# Altium schematic sheet SupplyAnalog.SchDoc
size A3; SheetNumber: 4; SheetTotal: 4
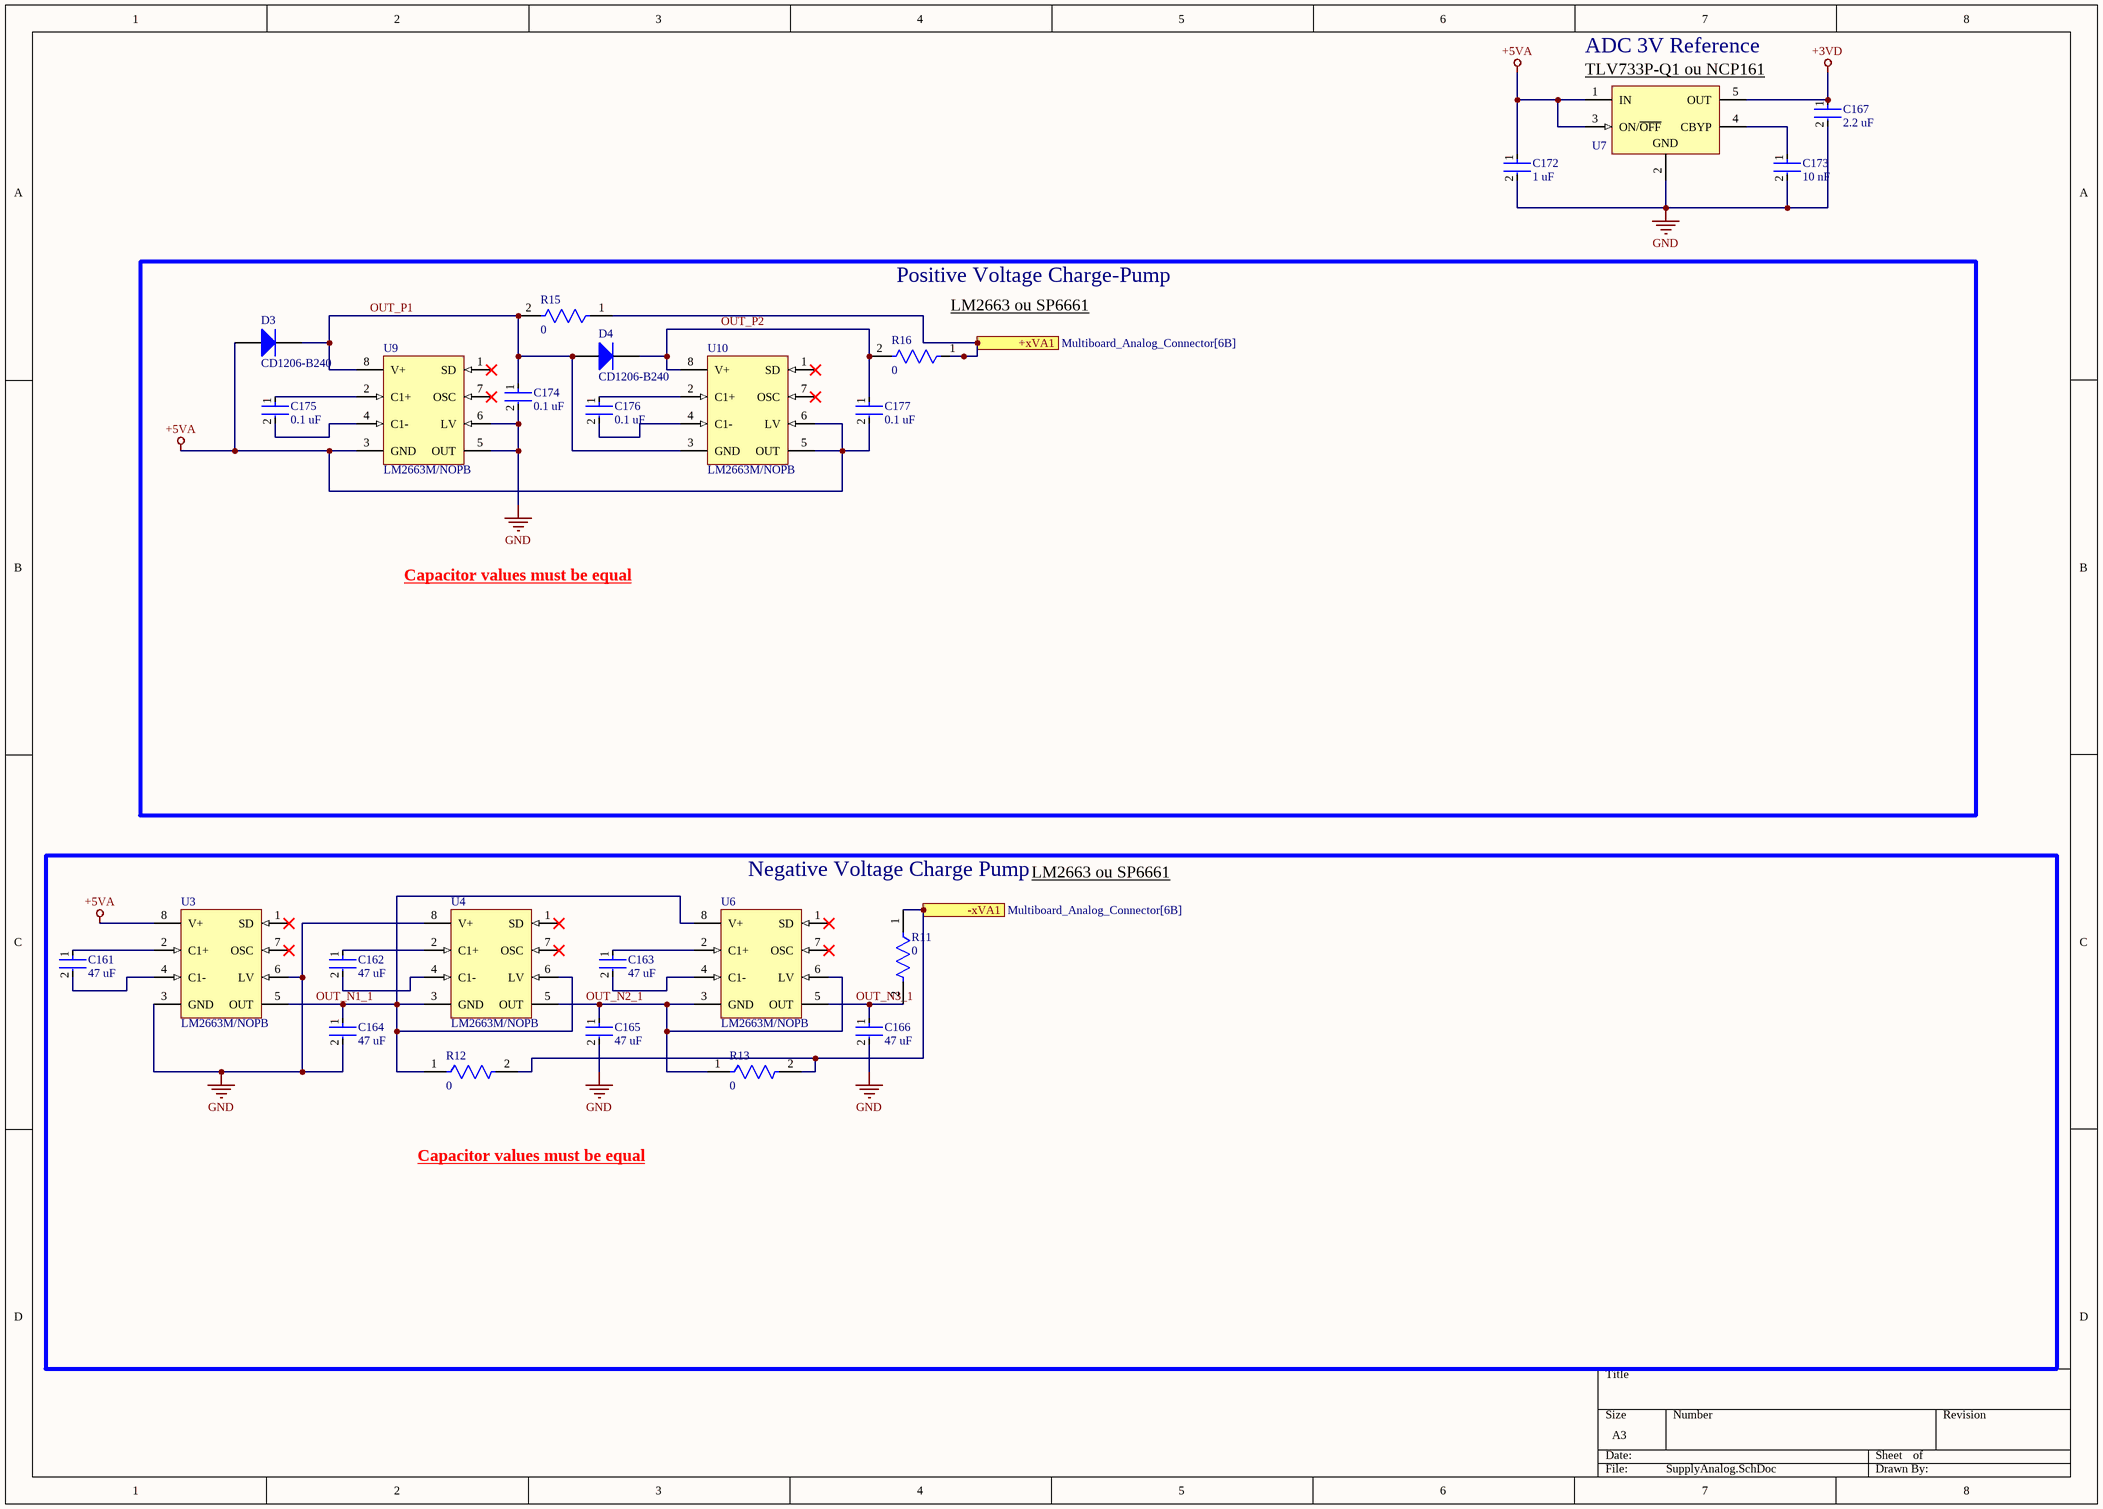
[diagram p0: SupplyAnalog.SchDoc]

## Parts
C161  47 uF  [FP-CC0805-0_85-MFG]
C162  47 uF  [FP-CC0805-0_85-MFG]
C163  47 uF  [FP-CC0805-0_85-MFG]
C164  47 uF  [FP-CC0805-0_85-MFG]
C165  47 uF  [FP-CC0805-0_85-MFG]
C166  47 uF  [FP-CC0805-0_85-MFG]
C167  2.2 uF  [FP-CC0805-0_85-MFG]
C172  1 uF  [FP-CC0805-0_85-MFG]
C173  10 nF  [FP-CC0805-0_85-MFG]
C174  0.1 uF  [FP-CC0805-0_85-MFG]
C175  0.1 uF  [FP-CC0805-0_85-MFG]
C176  0.1 uF  [FP-CC0805-0_85-MFG]
C177  0.1 uF  [FP-CC0805-0_85-MFG]
D3  CD1206-B240  [BOUR-CD1206-S01575-2_L]
D4  CD1206-B240  [BOUR-CD1206-S01575-2_L]
R11  0  [FP-RR1220-MFG]
R12  0  [FP-RR1220-MFG]
R13  0  [FP-RR1220-MFG]
R15  0  [FP-RR1220-MFG]
R16  0  [FP-RR1220-MFG]
U3  LM2663M/NOPB  [D0008A_N]
U4  LM2663M/NOPB  [D0008A_N]
U6  LM2663M/NOPB  [D0008A_N]
U7  LP2985AIM5-3.0/NOPB  [MF05A_L]  (value not drawn)
U9  LM2663M/NOPB  [D0008A_N]
U10  LM2663M/NOPB  [D0008A_N]

## Blocks framed on the sheet
Positive Voltage Charge-Pump: C174-C177 D3 D4 R15 R16 U9 U10
Negative Voltage Charge Pump: C161-C166 R11-R13 U3 U4 U6

## Ports
+xVA1 (see Multiboard_Analog_Connector[6B]), -xVA1 (see Multiboard_Analog_Connector[6B])

## Nets
+3VD: C167.1 U7.5(OUT)
+5VA: C172.1 C177.2 D3.1(A) U3.8(V+) U7.1(IN) U7.3(ON/~{OFF}) U9.3(GND) U10.5(OUT) U10.6(LV)
GND: C164.2 C165.2 C166.2 C167.2 C172.2 C173.2 C174.2 U3.3(GND) U3.6(LV) U4.8(V+) U7.2(GND) U9.5(OUT) U9.6(LV)
+xVA1: R15.1 R16.1 ; port +xVA1
-xVA1: R11.1 R12.2 R13.2 ; port -xVA1
OUT_N1_1: C164.1 R12.1 U3.5(OUT) U4.3(GND) U4.6(LV) U6.8(V+)
OUT_N2_1: C165.1 R13.1 U4.5(OUT) U6.3(GND) U6.6(LV)
OUT_N3_1: C166.1 R11.2 U6.5(OUT)
OUT_P1: C174.1 D3.2(K) D4.1(A) R15.2 U9.8(V+) U10.3(GND)
OUT_P2: C177.1 D4.2(K) R16.2 U10.8(V+)
NetC161_1: C161.1 U3.2(C1+)
NetC161_2: C161.2 U3.4(C1-)
NetC162_1: C162.1 U4.2(C1+)
NetC162_2: C162.2 U4.4(C1-)
NetC163_1: C163.1 U6.2(C1+)
NetC163_2: C163.2 U6.4(C1-)
NetC173_1: C173.1 U7.4(CBYP)
NetC175_1: C175.1 U9.2(C1+)
NetC175_2: C175.2 U9.4(C1-)
NetC176_1: C176.1 U10.2(C1+)
NetC176_2: C176.2 U10.4(C1-)

Not connected (* = marked no-connect by the designer): U3 1(SD)* 7(OSC)*; U4 1(SD)* 7(OSC)*; U6 1(SD)* 7(OSC)*; U9 1(SD)* 7(OSC)*; U10 1(SD)* 7(OSC)*

## Notes on the sheet
- (near U7) ADC 3V Reference
- (near U7) TLV733P-Q1 ou NCP161
- (near R16) LM2663 ou SP6661
- Capacitor values must be equal
- LM2663 ou SP6661

## Library data of the parts
C161-C167 C172-C177 = CMP-1036-04410-2: CAP CER 0.1UF 25V X7R 0805; Manufacturer Part Number: CC0805KRX7R8BB104; Manufacturer: Yageo; Tolerance: 0.1; Material: Ceramic; Value: 100 nF; ComponentLink2URL: http://www.yageo.com/documents/recent/UPY-GPHC_Y5V_6.3V-to-50V_8.pdf; Category: Cap; Mouser Description: Multilayer Ceramic Capacitors MLCC - SMD/SMT 100nF 25V X7R 10%; Device Class L1: Passive Components; Footprint Url: http://www.yageo.com/exep/pages/download/literatures/UPY-C_GEN_24.pdf; Height: 0.95mm; Digikey Description: CAP CER 0.1UF 25V X7R 0805; Lead Free: Yes; Temperature Range High: +85°C; Temperature: -30°C to +85°C; Ipc Land Pattern Name: CAPC200125X85; Capacitance: 100 nF; Automotive: No; Octopart: https://octopart.com/cc0805krx7r8bb104-yageo-39467766; Device Class L2: Capacitors; Temperature Characteristic: X7R; Voltage Rating: 25 V; ComponentLink2Description: Datasheet; Temperature Range Low: -30°C; Device Class L3: Ceramic Capacitors; RoHS: TRUE; Package: CC0805-0.85
D3 D4 = CMP-0583-00001-2: 75 V Small Signal Switching Diode, 150 mA, 2.5 uA, 1026 Molded Package, RoHS, Tape and Reel; Manufacturer: Bourns; PartNumber: CD1206-S01575; Reverse Voltage: 75 V; Average Forward Current: 150 mA; Reverse Current (Max.): 2.5 uA; Capacitance Between Terminals (Max.): 3 pF; Reverse Recovery Time (Max.): 4 nS; Forward Voltage (Max.): 1.00 V; Packing: Tape and Reel; Mounting Technology: Surface Mount; DatasheetVersion: Rev. 06/11; ComponentLink2URL: http://www.bourns.com/data/global/pdfs/CD1206_S01575.pdf; PackageReference: CD1206-S01575-2; RoHS: TRUE; ComponentLink1URL: http://www.bourns.com/; ComponentLink1Description: Manufacturer URL; ComponentLink3Description: Package Specification; ComponentLink3URL: http://www.bourns.com/data/global/pdfs/CD1206_S01575.pdf; ComponentLink2Description: Datasheet; PackageDescription: 2-Pin SMD, Body 3.2 x 1.5 mm
R11-R13 R15 R16 = CMP-2001-03560-2: 49.9Ω ±0.5% 0.1W 1/10W Chip Resistor 0805 (2012 Metric) Thin Film; Voltage Rating: 100V; Temperature Coefficient: 50ppm/°C; Max Power Dissipation: 100mW; Resistance: 49.9R; Packaging: Tape and Reel; Length: 0.079inch; Termination: SMD/SMT; Case Code (Metric): 2012; Voltage Rating (DC): 100V; Height: 0.02inch; Width: 0.049inch; RoHS Compliant: Yes; Tolerance: 0.5%; Case/Package: 0805; Resistance Tolerance: 0.5%; Lead Free: Lead Free; Size Code: 0805; Min Operating Temperature: -55°C; Max Operating Temperature: 125°C; Case Code (Imperial): 0805; Package Quantity: 1; Resistor Type: Thin Film; Number of Terminations: 2; Power Rating: 100mW; Series: RR
U3 U4 U6 U9 U10 = CMP-0065-00037-3: Switched Capacitor Voltage Converter, 8-pin Narrow SOIC, Pb-Free; Manufacturer: Texas Instruments; PackageTopMarking: NSZXTT*LM26*63M; CompType: Switch Caps; PowerWise: N; Code_IPC: SOIC127P600-8; PinCount: 8; ComponentLink1Description: Datasheet URL; PackageReference: D0008A; Code_JEDEC: MS-012-AA; PackageDescription: SOIC Narrow, 4.9 x 3.9 x 1.45mm, 8 Lead, 1.27mm Pitch; ComponentLink1URL: http://www.ti.com/general/docs/lit/getliterature.tsp?genericPartNumber=LM2663&fileType=pdf; RoHS: Y
U7 = CMP-0062-02011-2: Micropower 150 mA Low-Noise Ultra Low-Dropout Regulator, 5-pin SOT-23, Pb-Free; Manufacturer: National Semiconductor; PackageTopMarking: L0OA*XTT; PowerWise: N; CompType: LDO IC; ComponentLink3Description: MF05A Package Page; RoHS: Y; PackageVersion: revD, Aug-2008; PinCount: 5; RevisionNote: Component URLs added; PackageReference: MF05A; PackageDescription: Molded SOT-23, .115 x .063 x .040 in Body, 5 Lead, .0375 in Pitch; ComponentLink2Description: LP2985 Web Page; ComponentLink1URL: http://www.national.com/ds/LP/LP2985.pdf; DatasheetVersion: Jul-2007; ComponentLink2URL: http://www.national.com/pf/LP/LP2985.html; ComponentLink1Description: LP2985 Datasheet; ComponentLink3URL: http://www.national.com/packaging/folders/mf05a.html